# Altium schematic sheet CONNECTOR_A.SchDoc: =project_title
size Tabloid; CompanyName: Luxonis Holding; Organization: Luxonis Holding; Address1: 1925 Harmony Park Drive; Address2: Westminster, CO; Address3: 80234; Address4: United States; SheetNumber: 5; SheetTotal: 13
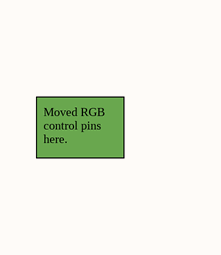
[diagram p0: CONNECTOR_A.SchDoc, left]
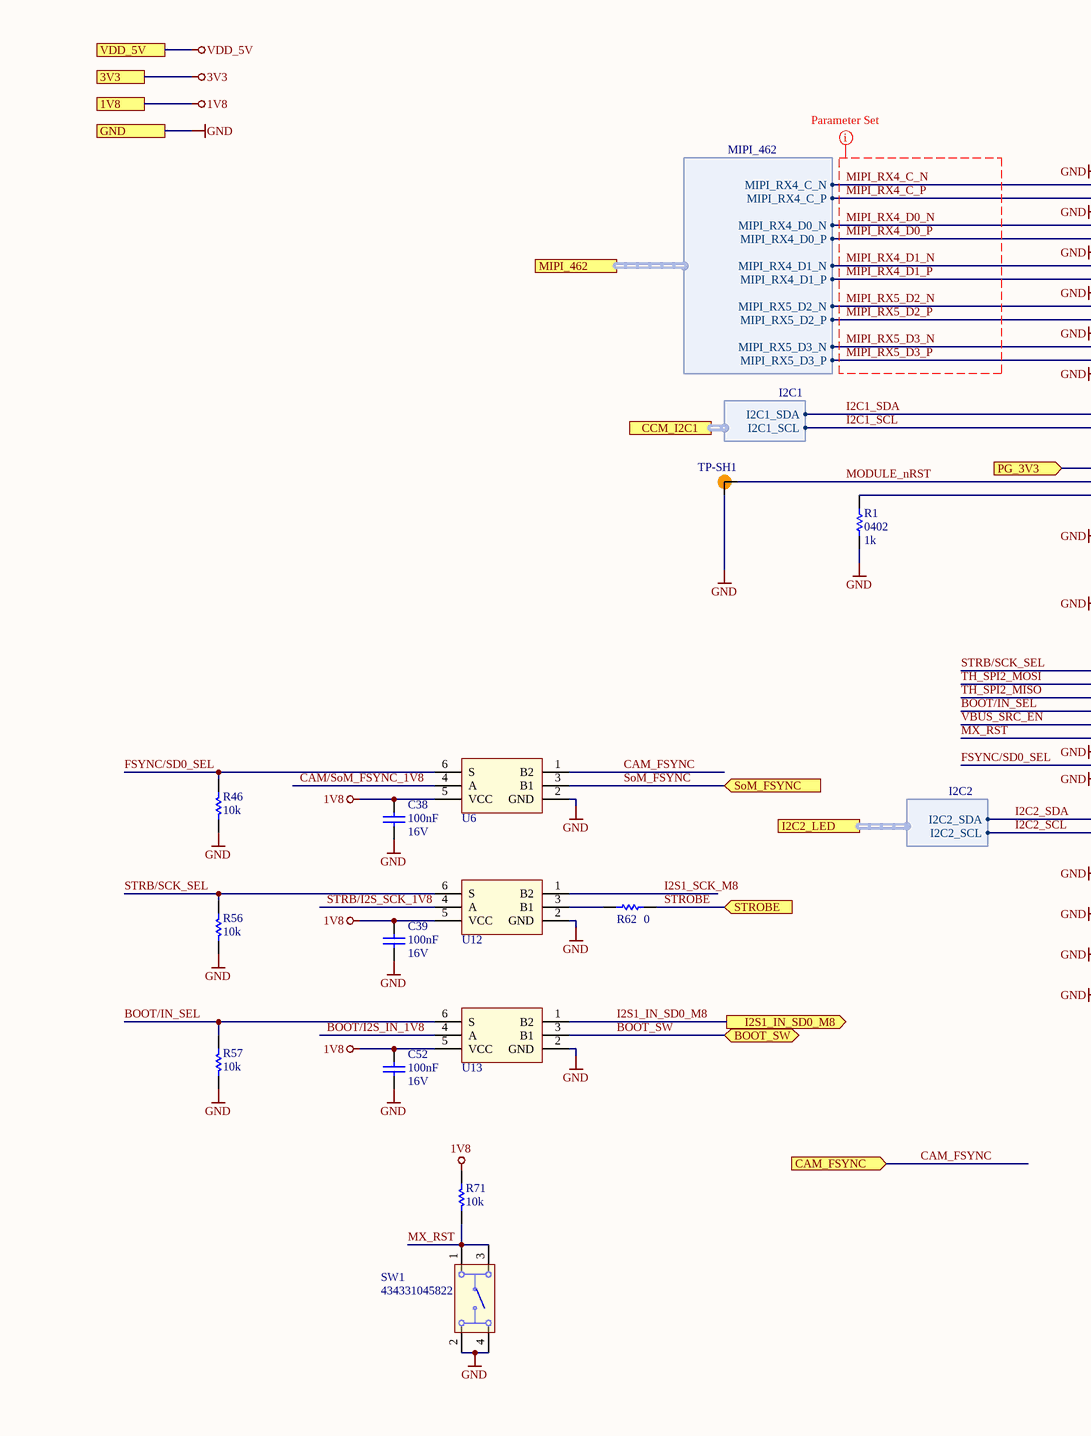
[diagram p1: CONNECTOR_A.SchDoc, middle]
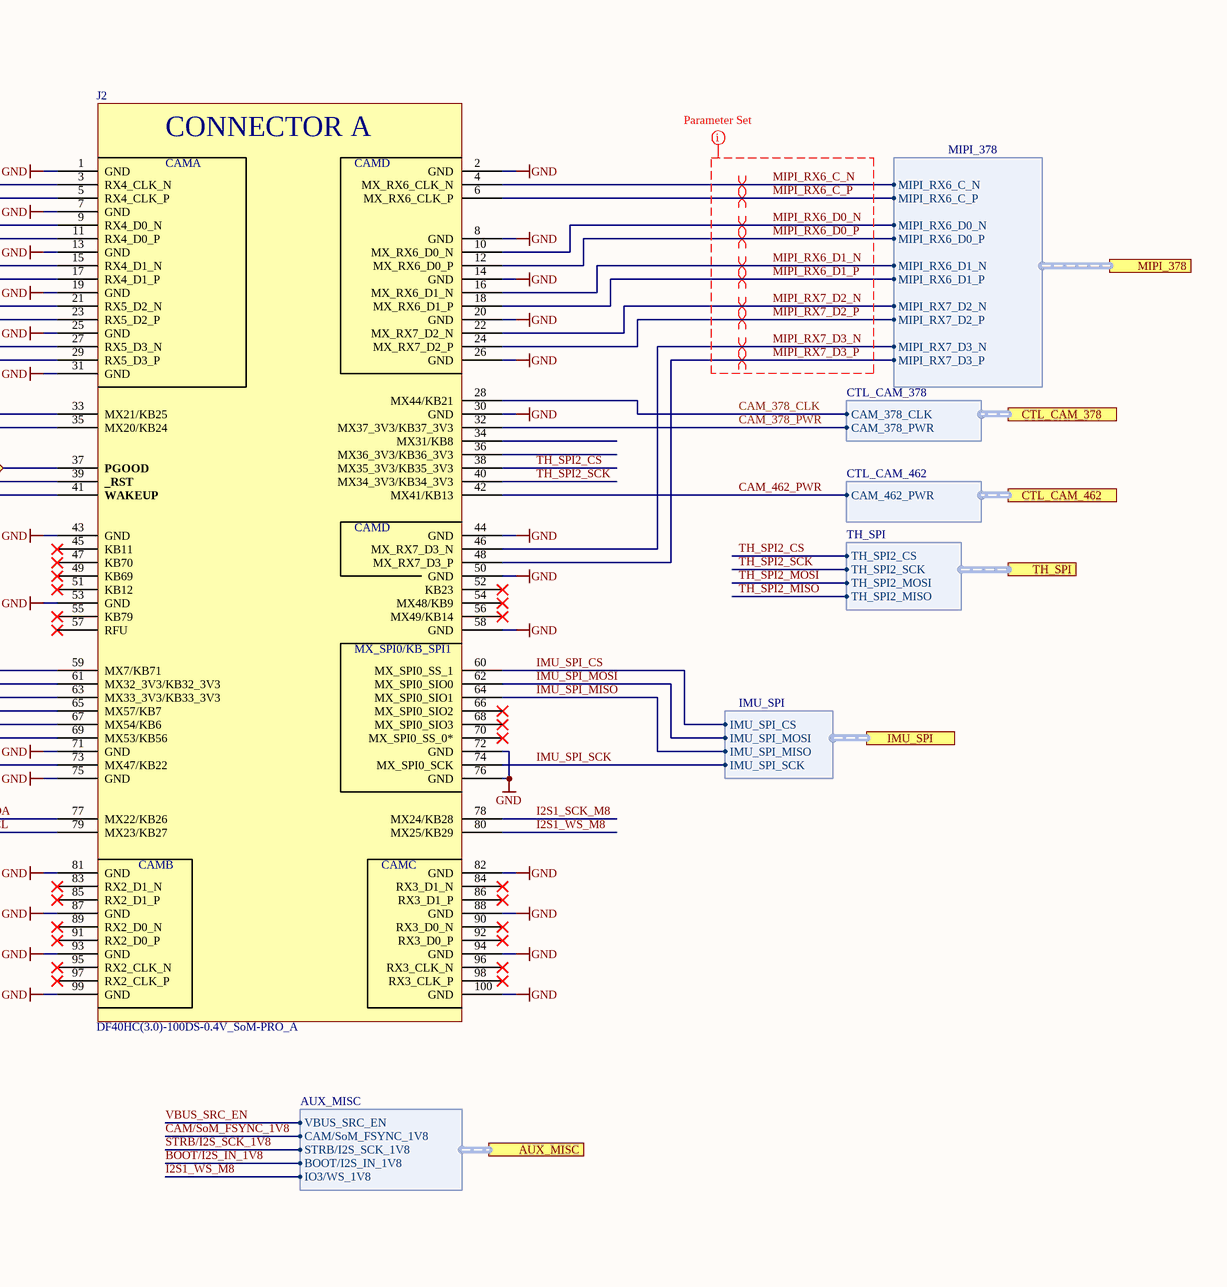
[diagram p2: CONNECTOR_A.SchDoc, right]

## Parts
C38  value 100nF  Voltage Rating: 16V  [CAPC0402(1005)60_L]  (hidden comment: CL05B104KO5NFNC)
C39  value 100nF  Voltage Rating: 16V  [CAPC0402(1005)60_L]  (hidden comment: CL05B104KO5NFNC)
C52  value 100nF  Voltage Rating: 16V  [CAPC0402(1005)60_L]  (hidden comment: CL05B104KO5NFNC)
J2  DF40HC(3.0)-100DS-0.4V_SoM-PRO_A  [CON_A_BW2099_SoM_DF40HC-3.0-100DS-0.4V_minpad]
R1  value 1k  Case/Package: 0402  [RESC1005X40X25ML05T05]  (hidden comment: ERJ-2RKF1001X)
R46  value 10k  [RESC0402(1005)_L]  (hidden comment: RC0402FR-1310KL)
R56  value 10k  [RESC0402(1005)_L]  (hidden comment: RC0402FR-1310KL)
R57  value 10k  [RESC0402(1005)_L]  (hidden comment: RC0402FR-1310KL)
R62  0  [RESC0402(1005)_L]
R71  value 10k  [RESC0402(1005)_L]  (hidden comment: RC0402FR-1310KL)
SW1  434331045822  [434331045822]
TP-SH1  TEST_SHORT  [TP_short]  (value not drawn)  (no BOM)
U6  SN74LVC1G3157DCKR  [DCK6_65]  (value not drawn)
U12  SN74LVC1G3157DCKR  [DCK6_65]  (value not drawn)
U13  SN74LVC1G3157DCKR  [DCK6_65]  (value not drawn)

## Ports
1V8, 3V3, AUX_MISC (harness AUX_MISC), BOOT_SW (bidir), CAM_FSYNC (in), CCM_I2C1 (harness I2C1), CTL_CAM_378 (harness CTL_CAM_378), CTL_CAM_462 (harness CTL_CAM_462), GND, I2C2_LED (harness I2C2), I2S1_IN_SD0_M8 (out), IMU_SPI (harness IMU_SPI), MIPI_378 (harness MIPI_378), MIPI_462 (harness MIPI_462), PG_3V3 (in), SoM_FSYNC (in), STROBE (in), TH_SPI (harness TH_SPI), VDD_5V

## Harnesses
I2C1: I2C1_SDA, I2C1_SCL
IMU_SPI: IMU_SPI_CS, IMU_SPI_MOSI, IMU_SPI_MISO, IMU_SPI_SCK
CTL_CAM_462: CAM_462_PWR
MIPI_462: MIPI_RX4_C_N, MIPI_RX4_C_P, MIPI_RX4_D0_N, MIPI_RX4_D0_P, MIPI_RX4_D1_N, MIPI_RX4_D1_P, MIPI_RX5_D2_N, MIPI_RX5_D2_P, MIPI_RX5_D3_N, MIPI_RX5_D3_P
MIPI_378: MIPI_RX6_C_N, MIPI_RX6_C_P, MIPI_RX6_D0_N, MIPI_RX6_D0_P, MIPI_RX6_D1_N, MIPI_RX6_D1_P, MIPI_RX7_D2_N, MIPI_RX7_D2_P, MIPI_RX7_D3_N, MIPI_RX7_D3_P
AUX_MISC: VBUS_SRC_EN, CAM/SoM_FSYNC_1V8, STRB/I2S_SCK_1V8, BOOT/I2S_IN_1V8, IO3/WS_1V8
CTL_CAM_378: CAM_378_CLK, CAM_378_PWR
TH_SPI: TH_SPI2_CS, TH_SPI2_SCK, TH_SPI2_MOSI, TH_SPI2_MISO
I2C2: I2C2_SDA, I2C2_SCL

## Nets
1V8: C38.2 C39.2 C52.2 R71.2 U6.5(VCC) U12.5(VCC) U13.5(VCC) ; port 1V8
3V3: port 3V3
GND: C38.1 C39.1 C52.1 J2.1(GND) J2.2(GND) J2.7(GND) J2.8(GND) J2.13(GND) J2.14(GND) J2.19(GND) J2.20(GND) J2.25(GND) J2.26(GND) J2.30(GND) J2.31(GND) J2.43(GND) J2.44(GND) J2.50(GND) J2.53(GND) J2.58(GND) J2.71(GND) J2.72(GND) J2.75(GND) J2.76(GND) J2.81(GND) J2.82(GND) J2.87(GND) J2.88(GND) J2.93(GND) J2.94(GND) J2.99(GND) J2.100(GND) R1.1 R46.1 R56.1 R57.1 SW1.2 SW1.4 TP-SH1.1 U6.2(GND) U12.2(GND) U13.2(GND) ; port GND
VDD_5V: port VDD_5V
BOOT/I2S_IN_1V8: U13.4(A) ; port AUX_MISC.BOOT/I2S_IN_1V8
BOOT/IN_SEL: J2.65(MX57/KB7) R57.2 U13.6(S)
BOOT_SW: U13.3(B1) ; port BOOT_SW
CAM/SoM_FSYNC_1V8: U6.4(A) ; port AUX_MISC.CAM/SoM_FSYNC_1V8
CAM_378_CLK: J2.28(MX44/KB21) ; port CTL_CAM_378.CAM_378_CLK
CAM_378_PWR: J2.32(MX37_3V3/KB37_3V3) ; port CTL_CAM_378.CAM_378_PWR
CAM_462_PWR: J2.42(MX41/KB13) ; port CTL_CAM_462.CAM_462_PWR
CAM_FSYNC: U6.1(B2) ; port CAM_FSYNC
FSYNC/SD0_SEL: J2.73(MX47/KB22) R46.2 U6.6(S)
I2C1_SCL: J2.35(MX20/KB24) ; port CCM_I2C1.I2C1_SCL
I2C1_SDA: J2.33(MX21/KB25) ; port CCM_I2C1.I2C1_SDA
I2C2_SCL: J2.79(MX23/KB27) ; port I2C2_LED.I2C2_SCL
I2C2_SDA: J2.77(MX22/KB26) ; port I2C2_LED.I2C2_SDA
I2S1_IN_SD0_M8: U13.1(B2) ; port I2S1_IN_SD0_M8
I2S1_SCK_M8: J2.78(MX24/KB28) U12.1(B2)
I2S1_WS_M8: J2.80(MX25/KB29) ; port AUX_MISC.IO3/WS_1V8
IMU_SPI_CS: J2.60(MX_SPI0_SS_1) ; port IMU_SPI.IMU_SPI_CS
IMU_SPI_MISO: J2.64(MX_SPI0_SIO1) ; port IMU_SPI.IMU_SPI_MISO
IMU_SPI_MOSI: J2.62(MX_SPI0_SIO0) ; port IMU_SPI.IMU_SPI_MOSI
IMU_SPI_SCK: J2.74(MX_SPI0_SCK) ; port IMU_SPI.IMU_SPI_SCK
MIPI_RX4_C_N: J2.3(RX4_CLK_N) ; port MIPI_462.MIPI_RX4_C_N
MIPI_RX4_C_P: J2.5(RX4_CLK_P) ; port MIPI_462.MIPI_RX4_C_P
MIPI_RX4_D0_N: J2.9(RX4_D0_N) ; port MIPI_462.MIPI_RX4_D0_N
MIPI_RX4_D0_P: J2.11(RX4_D0_P) ; port MIPI_462.MIPI_RX4_D0_P
MIPI_RX4_D1_N: J2.15(RX4_D1_N) ; port MIPI_462.MIPI_RX4_D1_N
MIPI_RX4_D1_P: J2.17(RX4_D1_P) ; port MIPI_462.MIPI_RX4_D1_P
MIPI_RX5_D2_N: J2.21(RX5_D2_N) ; port MIPI_462.MIPI_RX5_D2_N
MIPI_RX5_D2_P: J2.23(RX5_D2_P) ; port MIPI_462.MIPI_RX5_D2_P
MIPI_RX5_D3_N: J2.27(RX5_D3_N) ; port MIPI_462.MIPI_RX5_D3_N
MIPI_RX5_D3_P: J2.29(RX5_D3_P) ; port MIPI_462.MIPI_RX5_D3_P
MIPI_RX6_C_N: J2.4(MX_RX6_CLK_N) ; port MIPI_378.MIPI_RX6_C_N
MIPI_RX6_C_P: J2.6(MX_RX6_CLK_P) ; port MIPI_378.MIPI_RX6_C_P
MIPI_RX6_D0_N: J2.10(MX_RX6_D0_N) ; port MIPI_378.MIPI_RX6_D0_N
MIPI_RX6_D0_P: J2.12(MX_RX6_D0_P) ; port MIPI_378.MIPI_RX6_D0_P
MIPI_RX6_D1_N: J2.16(MX_RX6_D1_N) ; port MIPI_378.MIPI_RX6_D1_N
MIPI_RX6_D1_P: J2.18(MX_RX6_D1_P) ; port MIPI_378.MIPI_RX6_D1_P
MIPI_RX7_D2_N: J2.22(MX_RX7_D2_N) ; port MIPI_378.MIPI_RX7_D2_N
MIPI_RX7_D2_P: J2.24(MX_RX7_D2_P) ; port MIPI_378.MIPI_RX7_D2_P
MIPI_RX7_D3_N: J2.46(MX_RX7_D3_N) ; port MIPI_378.MIPI_RX7_D3_N
MIPI_RX7_D3_P: J2.48(MX_RX7_D3_P) ; port MIPI_378.MIPI_RX7_D3_P
MODULE_nRST: J2.39(_RST) TP-SH1.2
MX_RST: J2.69(MX53/KB56) R71.1 SW1.1 SW1.3
PG_3V3: J2.37(PGOOD) ; port PG_3V3
SoM_FSYNC: U6.3(B1) ; port SoM_FSYNC
STRB/I2S_SCK_1V8: U12.4(A) ; port AUX_MISC.STRB/I2S_SCK_1V8
STRB/SCK_SEL: J2.59(MX7/KB71) R56.2 U12.6(S)
STROBE: R62.1 ; port STROBE
TH_SPI2_CS: J2.38(MX35_3V3/KB35_3V3) ; port TH_SPI.TH_SPI2_CS
TH_SPI2_MISO: J2.63(MX33_3V3/KB33_3V3) ; port TH_SPI.TH_SPI2_MISO
TH_SPI2_MOSI: J2.61(MX32_3V3/KB32_3V3) ; port TH_SPI.TH_SPI2_MOSI
TH_SPI2_SCK: J2.40(MX34_3V3/KB34_3V3) ; port TH_SPI.TH_SPI2_SCK
VBUS_SRC_EN: J2.67(MX54/KB6) ; port AUX_MISC.VBUS_SRC_EN
NetJ2_41: J2.41(WAKEUP) R1.2
NetR62_2: R62.2 U12.3(B1)

Not connected (* = marked no-connect by the designer): J2 34(MX31/KB8) 36(MX36_3V3/KB36_3V3) 45(KB11)* 47(KB70)* 49(KB69)* 51(KB12)* 52(KB23)* 54(MX48/KB9)* 55(KB79)* 56(MX49/KB14)* 57(RFU)* 66(MX_SPI0_SIO2)* 68(MX_SPI0_SIO3)* 70(MX_SPI0_SS_0*)* 83(RX2_D1_N)* 84(RX3_D1_N)* 85(RX2_D1_P)* 86(RX3_D1_P)* 89(RX2_D0_N)* 90(RX3_D0_N)* 91(RX2_D0_P)* 92(RX3_D0_P)* 95(RX2_CLK_N)* 96(RX3_CLK_N)* 97(RX2_CLK_P)* 98(RX3_CLK_P)*

## Layout directives
differential pair; differential pair class 100ohm: MIPI_RX6_C_N, MIPI_RX6_C_P, MIPI_RX6_D0_N, MIPI_RX6_D0_P, MIPI_RX6_D1_N, MIPI_RX6_D1_P, MIPI_RX7_D2_N, MIPI_RX7_D2_P, MIPI_RX7_D3_N, MIPI_RX7_D3_P
net class MIPI_IMX378: MIPI_RX6_C_N, MIPI_RX6_C_P, MIPI_RX6_D0_N, MIPI_RX6_D0_P, MIPI_RX6_D1_N, MIPI_RX6_D1_P, MIPI_RX7_D2_N, MIPI_RX7_D2_P, MIPI_RX7_D3_N, MIPI_RX7_D3_P
net class MIPI_IMX462: MIPI_RX4_C_N, MIPI_RX4_C_P, MIPI_RX4_D0_N, MIPI_RX4_D0_P, MIPI_RX4_D1_N, MIPI_RX4_D1_P, MIPI_RX5_D2_N, MIPI_RX5_D2_P, MIPI_RX5_D3_N, MIPI_RX5_D3_P

## Notes on the sheet
- Moved RGB control pins here.
- Title
- Size:
- Date:
- Tabloid
- Number:
- Time:
- Revision:
- Sheet
- of
- Drawn by:
- (in symbol CMP-002-00154-9) CONNECTOR A; CAMA; CAMD; MX_SPI0/KB_SPI1; CAMB; CAMC

## Library data of the parts
C38 C39 C52 = CMP-108-000002-6: CAP CER 0.1UF 16V X7R 0402 10%; Manufacturer 1: Samsung; Case/Package: 0402; ComponentLink1URL: https://datasheet.ciiva.com/25767/cl05b104ko5nfnc-25767124.pdf?src-supplier=Digi-Key; Length: 1mm; Design Item ID: CL05B104KO5NFNC; Tolerance: 10%; Min Operating Temperature: -55°C; Width: 0.02inch; Dielectric: X7R; ComponentLink1Description: https://datasheet.ciiva.com/25767/cl05b104ko5nfnc-25767124.pdf?src-supplier=Digi-Key; Height: 0.5mm; Depth: 0.5mm; Manufacturer Part Number 1: CL05B104KO5NFNC; Max Operating Temperature: 125°C; Mounting Technology: SMT
J2 = CMP-002-00154-9: OAK-SoM-Pro_S2/S3 base board conn. A; Manufacturer Part Number 1: DF40HC(3.0)-100DS-0.4V(58); Manufacturer 1: Hirose; System: Connector; Pitch: 0.016inch; Connector Type: Receptacle; Gender: Female; Number of Positions: 100; Stock 2: 2078; RoHS: Yes; ComponentLink3URL: https://datasheet.ciiva.com/13559/ed-df40-20140305-13559540.pdf?src-supplier=Mouser; Package Quantity: 1000; ComponentLink1Description: https://datasheet.ciiva.com/46636/ed-df40-20140305-46636517.pdf?src-supplier=Digi-Key; ComponentLink3Description: https://datasheet.ciiva.com/13559/ed-df40-20140305-13559540.pdf?src-supplier=Mouser; Mounting Technology: SMT; Number of Rows: 2; Mount: Surface Mount; Packaging: Tape and Reel; ComponentLink1URL: https://datasheet.ciiva.com/46636/ed-df40-20140305-46636517.pdf?src-supplier=Digi-Key; Stock 1: 2172; Contact Plating: Gold; Pricing 1: 1=2.54000, 10=2.26000, 25=2.07000, 50=2.07000, 100=1.98000, 250=1.79000, 500=1.65000, 1000=1.41000, 3000=1.32000, 6000=1.23000, 10000=1.23000 (USD); ComponentLink4URL: https://datasheet.ciiva.com/18562/ed-df40-20140305-18562462.pdf?src-supplier=Digi-Key; ComponentLink2Description: https://datasheet.ciiva.com/18562/ed-df40-20140305-18562189.pdf?src-supplier=Digi-Key; Design Item ID: DF40HC(3.0)-100DS-0.4V_SoM-PRO_A; ComponentLink4Description: https://datasheet.ciiva.com/18562/ed-df40-20140305-18562462.pdf?src-supplier=Digi-Key; Source: LuxonisMaster.SchLib; Pricing 2: 1=2.50000, 10=2.40000, 25=2.10000, 50=2.10000, 100=2.00000, 250=1.76000, 500=1.71000, 1000=1.45000, 2000=1.36000, 5000=1.31000, 10000=1.31000 (USD); Pins: 100; Lead Free: Lead Free; ComponentLink2URL: https://datasheet.ciiva.com/18562/ed-df40-20140305-18562189.pdf?src-supplier=Digi-Key
R1 = CMP-009-00009-15: RES SMD 1K OHM 1% 0.1W 0402; Manufacturer 1: Panasonic; Voltage Rating: 50V; Power Rating: 100mW; Tolerance: 1%; Max Operating Temperature: 155°C; Manufacturer Part Number 1: ERJ-2RKF1001X; Min Operating Temperature: -55°C
R46 R56 R57 R71 = CMP-115-000004-8: RES SMD 10K OHM 1% 1/16W 0402; Manufacturer 1: Yageo; Power Rating: 62.5mW; Temperature Coefficient: 100ppm/°C; Voltage Rating: 50V; Tolerance: 1%; Max Operating Temperature: 155°C; Case/Package: 0402; Manufacturer Part Number 1: RC0402FR-1310KL; Min Operating Temperature: -55°C; Design Item ID: RC0402FR-1310KL
R62 = CMP-013-000022-11: RES SMD 0 OHM 5% 1/16W 0402; Manufacturer 1: Vishay; Manufacturer Part Number 1: CRCW04020000Z0ED; Power Rating: 63mW; Voltage Rating: 50V; Case/Package: 0402; Min Operating Temperature: -55°C; Max Operating Temperature: 155°C; Tolerance: 5%; Value: 0; Design Item ID: CRCW04020000Z0ED
SW1 = CMP-011-00016-3: Keypad Switch, 1 Switches, SPST, Momentary-tactile, 0.05A, 12VDC, 2.65N, Solder Terminal, Surface Mount-right Angle; Manufacturer 1: Wurth Electronics; Voltage Rating: 12V; Max Current Rating: 50mA; Throw Configuration: SPST-NO; Supplier Part Number 1: 732-7055-2-ND; Manufacturer part number 1: 434331045822; Pins: 4; Supplier 1: Digi-Key; Current Rating: 50mA; Mounting Technology: SMD; Case/Package: 434331045822
TP-SH1 = CMP-249-000001-3: Manufacturer Part Number 1: /; Source: DM9098.SchLib; Design Item ID: TEST_SHORT
U6 U12 U13 = CMP-010-000023-3: IC SWITCH SPDT SC70-6 1 Circuit IC Switch 2:1 15Ohm SC-70-6; Manufacturer 1: Texas Instruments; Max Operating Temperature: 125°C; Manufacturer Part Number 1: SN74LVC1G3157DCKR; Min Operating Temperature: -40°C; Case/Package: SC